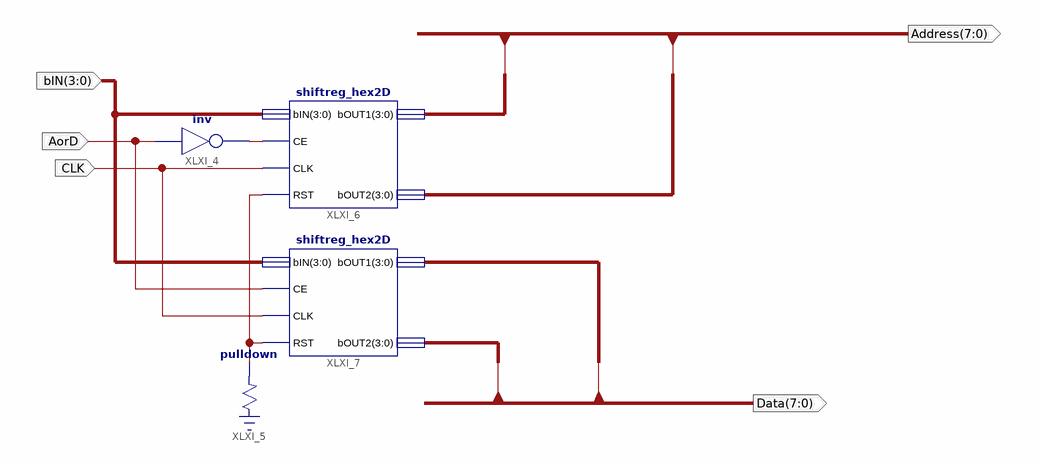
[diagram p0: schematic sheet 1]
// Xilinx ISE schematic test_hexShifter.sch (spartan3e) as structural Verilog: 4 symbols, 5 ports
module test_hexShifter (
  input  [3:0] bIN,
  input  CLK,
  input  AorD,
  output [7:0] Address,
  output [7:0] Data
);

  wire XLXN_13, XLXN_15;

  not XLXI_4 (XLXN_13, AorD);
  \pulldown  XLXI_5 (.O(XLXN_15));
  shiftreg_hex2D XLXI_6 (.CLK(CLK), .bIN(bIN), .RST(XLXN_15), .CE(XLXN_13), .bOUT1(Address[3:0]), .bOUT2(Address[7:4]));
  shiftreg_hex2D XLXI_7 (.CLK(CLK), .bIN(bIN), .RST(XLXN_15), .CE(AorD), .bOUT1(Data[3:0]), .bOUT2(Data[7:4]));
endmodule
